# Altium schematic sheet main_board.SchDoc
size A4
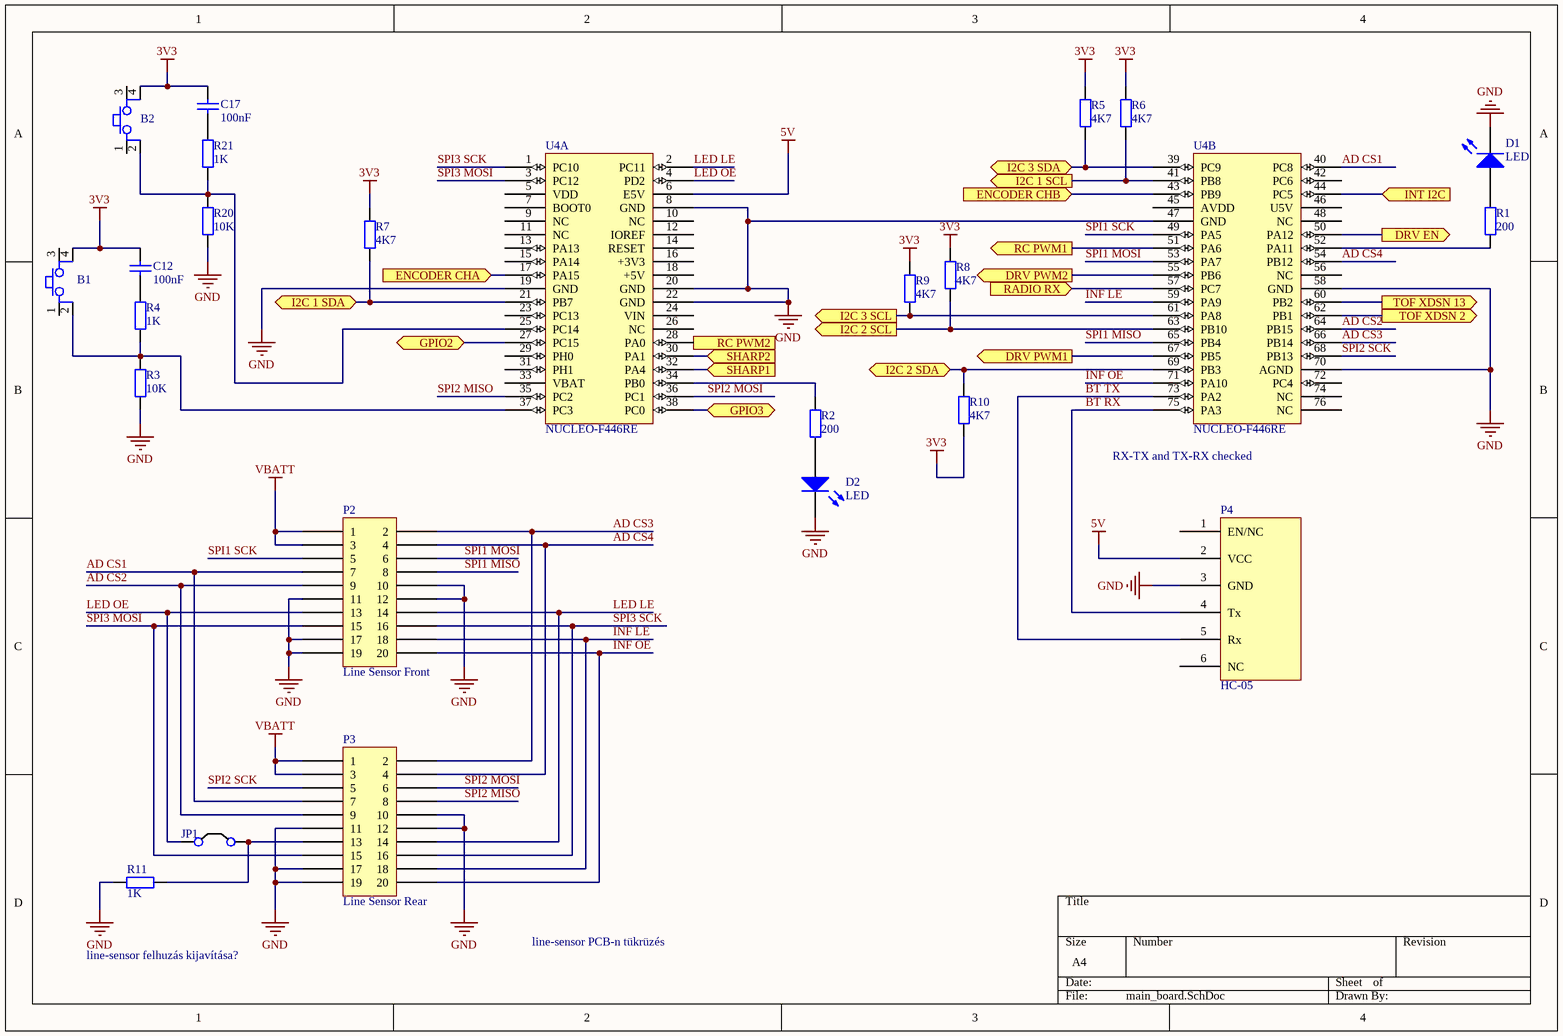
[diagram p0: main_board.SchDoc]

## Parts
B1  Button  [FP_BTN_SMD]  (value not drawn)
B2  Button  [FP_BTN_SMD]  (value not drawn)
C12  100nF  [FP_0805_CAP_085]
C17  100nF  [FP_0805_CAP_085]
D1  LED  [FP_0805_LED_RED]
D2  LED  [FP_0805_LED_RED]
JP1  JUMPER  [FP_CONN2_TUSKE_254MM]  (value not drawn)
P2  Line Sensor Front  [FP_CONN20PINS_LOMEX]
P3  Line Sensor Rear  [FP_CONN20PINS_LOMEX]
P4  HC-05  [FP_CONN6_TAP_254MM]
R1  200  [FP_0805_RES]
R2  200  [FP_0805_RES]
R3  10K  [FP_0805_RES]
R4  1K  [FP_0805_RES]
R5  4K7  [FP_1206_RES]
R6  4K7  [FP_1206_RES]
R7  4K7  [FP_1206_RES]
R8  4K7  [FP_1206_RES]
R9  4K7  [FP_1206_RES]
R10  4K7  [FP_1206_RES]
R11  1K  [FP_0805_RES]
R20  10K  [FP_0805_RES]
R21  1K  [FP_0805_RES]
U4  NUCLEO-F446RE  [FP_NUCLEO-64_2x20]  (parts A,B of 2)

## Ports
DRV EN (out), DRV PWM1 (out), DRV PWM2 (out), ENCODER CHA (in), ENCODER CHB (in), GPIO2 (bidir), GPIO3 (bidir), I2C 1 SCL (out), I2C 1 SDA (bidir), I2C 2 SCL (out), I2C 2 SDA (bidir), I2C 3 SCL (out), I2C 3 SDA (bidir), INT I2C (in), RADIO RX (in), RC PWM1 (out), RC PWM2 (out), SHARP1 (in), SHARP2 (in), TOF XDSN 2 (out), TOF XDSN 13 (out)

## Nets
3V3: B1.4 B2.4 C12.2 C17.2 R5.2 R6.2 R7.2 R8.2 R9.2 R10.1
5V: P4.2(VCC) U4.6(E5V)
GND: D1.2(K) D2.2(K) P2.10 P2.11 P2.12 P2.17 P2.19 P3.10 P3.11 P3.12 P3.17 P3.19 P4.3(GND) R3.1 R11.2 R20.1 U4.8(GND) U4.19(GND) U4.20(GND) U4.22(GND) U4.47(GND) U4.58(GND) U4.70(AGND)
VBATT: P2.1 P2.3 P3.1 P3.3
AD CS1: P2.7 P3.7 U4.40(PC8)
AD CS2: P2.9 P3.9 U4.64(PB15)
AD CS3: P2.2 P3.2 U4.66(PB14)
AD CS4: P2.4 P3.4 U4.54(PB12)
BT RX: P4.4(Tx) U4.75(PA3)
BT TX: P4.5(Rx) U4.73(PA2)
DRV EN: U4.50(PA12) ; port DRV EN
DRV PWM1: U4.67(PB5) ; port DRV PWM1
DRV PWM2: U4.55(PB6) ; port DRV PWM2
ENCODER CHA: U4.17(PA15) ; port ENCODER CHA
ENCODER CHB: U4.43(PB9) ; port ENCODER CHB
GPIO2: U4.27(PC15) ; port GPIO2
GPIO3: U4.38(PC0) ; port GPIO3
I2C 1 SCL: R6.1 U4.41(PB8) ; port I2C 1 SCL
I2C 1 SDA: R7.1 U4.21(PB7) ; port I2C 1 SDA
I2C 2 SCL: R8.1 U4.63(PB10) ; port I2C 2 SCL
I2C 2 SDA: R10.2 U4.69(PB3) ; port I2C 2 SDA
I2C 3 SCL: R9.1 U4.61(PA8) ; port I2C 3 SCL
I2C 3 SDA: R5.1 U4.39(PC9) ; port I2C 3 SDA
INF LE: P2.18 P3.18 U4.59(PA9)
INF OE: P2.20 P3.20 U4.71(PA10)
INT I2C: U4.44(PC5) ; port INT I2C
LED LE: P2.14 P3.14 U4.2(PC11)
LED OE: JP1.1(C1) P2.13 U4.4(PD2)
RADIO RX: U4.57(PC7) ; port RADIO RX
RC PWM1: U4.51(PA6) ; port RC PWM1
RC PWM2: U4.28(PA0) ; port RC PWM2
SHARP1: U4.32(PA4) ; port SHARP1
SHARP2: U4.30(PA1) ; port SHARP2
SPI1 MISO: P2.8 U4.65(PB4)
SPI1 MOSI: P2.6 U4.53(PA7)
SPI1 SCK: P2.5 U4.49(PA5)
SPI2 MISO: P3.8 U4.35(PC2)
SPI2 MOSI: P3.6 U4.36(PC1)
SPI2 SCK: P3.5 U4.68(PB13)
SPI3 MOSI: P2.15 P3.15 U4.3(PC12)
SPI3 SCK: P2.16 P3.16 U4.1(PC10)
TOF XDSN 2: U4.62(PB1) ; port TOF XDSN 2
TOF XDSN 13: U4.60(PB2) ; port TOF XDSN 13
NetB1_2: B1.2 R3.2 R4.1 U4.37(PC3)
NetB2_2: B2.2 R20.2 R21.1 U4.25(PC14)
NetC12_1: C12.1 R4.2
NetC17_1: C17.1 R21.2
NetD1_1: D1.1(A) R1.1
NetD2_1: D2.1(A) R2.1
NetJP1_2: JP1.2(C2) P3.13 R11.1
NetR1_2: R1.2 U4.52(PA11)
NetR2_2: R2.2 U4.34(PB0)

Not connected (* = marked no-connect by the designer): B1 1 3; B2 1 3; P4 1(EN/NC) 6(NC); U4 5(VDD) 7(BOOT0) 9(NC) 10(NC) 11(NC) 12(IOREF) 13(PA13) 14(RESET) 15(PA14) 16(+3V3) 18(+5V) 23(PC13) 24(VIN) 26(NC) 29(PH0) 31(PH1) 33(VBAT) 42(PC6) 45(AVDD) 46(U5V) 48(NC) 56(NC) 72(PC4) 74(NC) 76(NC)

## Notes on the sheet
- (near U4) RX-TX and TX-RX checked
- line-sensor felhuzás kijavítása?
- line-sensor PCB-n tükrüzés

## Library data of the parts
B1 B2 = Button 4P: Push button; Reference: https://hu.mouser.com/ProductDetail/TE-Connectivity-Alcoswitch/FSM2JSMAATR?qs=g%252BEszo6zu8MKdISiZRITCQ%3D%3D; Supplier: Mouser
C12 C17 = CAP: Capacitor; Supplier: Farnell; Reference: https://hu.farnell.com/yageo/cc1206krx7r8bb104/cap-0-1-f-25v-10-x7r-1206/dp/644316?st=capacitor%20smd; Value: 100nF
D1 D2 = LED: Typical RED GaAs LED; pin to pad: 1>A 2>K
JP1 = JUMPER_CONN: Jumper Wire (Connected)
P2 P3 = 302-S201: Conn Shrouded Header HDR 20 POS 2.54mm Solder ST Thru-Hole; Manufacturer: On-Shore Technology; Number of Positions: 20; Connector Type: Male Pin; Pitch: 0.1inch; Supplier 1: Digi-Key; Manufacturer Part Number: 302-S201; RoHS: Yes; Category: Headers and Wire Housings; Stock 1: 299353; Pricing 1: 1=0,48000, 10=0,40700, 160=0,31675, 480=0,27148, 960=0,22624, 4960=0,19392, 10080=0,18099 (USD); Mount: Through Hole; Color: Black; Contact Plating: Gold; Number of Rows: 2; Packaging: Tray; Termination: Solder; Series: 302; Contact Type: Male Pin; Row Spacing: 0.1inch; RoHS Compliant: Yes; ComponentLink1URL: https://datasheet.ciiva.com/742/302-sxxx-742190.pdf?src-supplier=Digi-Key; ComponentLink1Description: https://datasheet.ciiva.com/742/302-sxxx-742190.pdf?src-supplier=Digi-Key
R1-R11 R20 R21 = RES: Resistor
  R1 R2: Value: 200
  R3 R20: Supplier: Farnell; Reference: https://hu.farnell.com/multicomp/mcmr12x1002ftl/res-10k-1-0-25w-1206-ceramic/dp/2073878; Value: 10K
  R4 R21: Supplier: Farnell; Reference: https://hu.farnell.com/te-connectivity/crgh1206j1k0/res-1k-5-0-5w-1206-thick-film/dp/2331865; Value: 1K
  R5-R10: Supplier: Farnell; Reference: https://hu.farnell.com/yageo/rc1206fr-074k7l/res-4k7-1-0-25w-1206-thick-film/dp/9240985; Value: 4K7
  R11: Value: 1K
U4 = NUCLEO-F446RE: Reference: NUCLEO; Name: Nucleo F446RE; Supplier: Tanszék